# Altium schematic sheet YTN1-E608-WIFI_V1_6432..schdoc
size A3; SheetNumber: 0; SheetTotal: 0
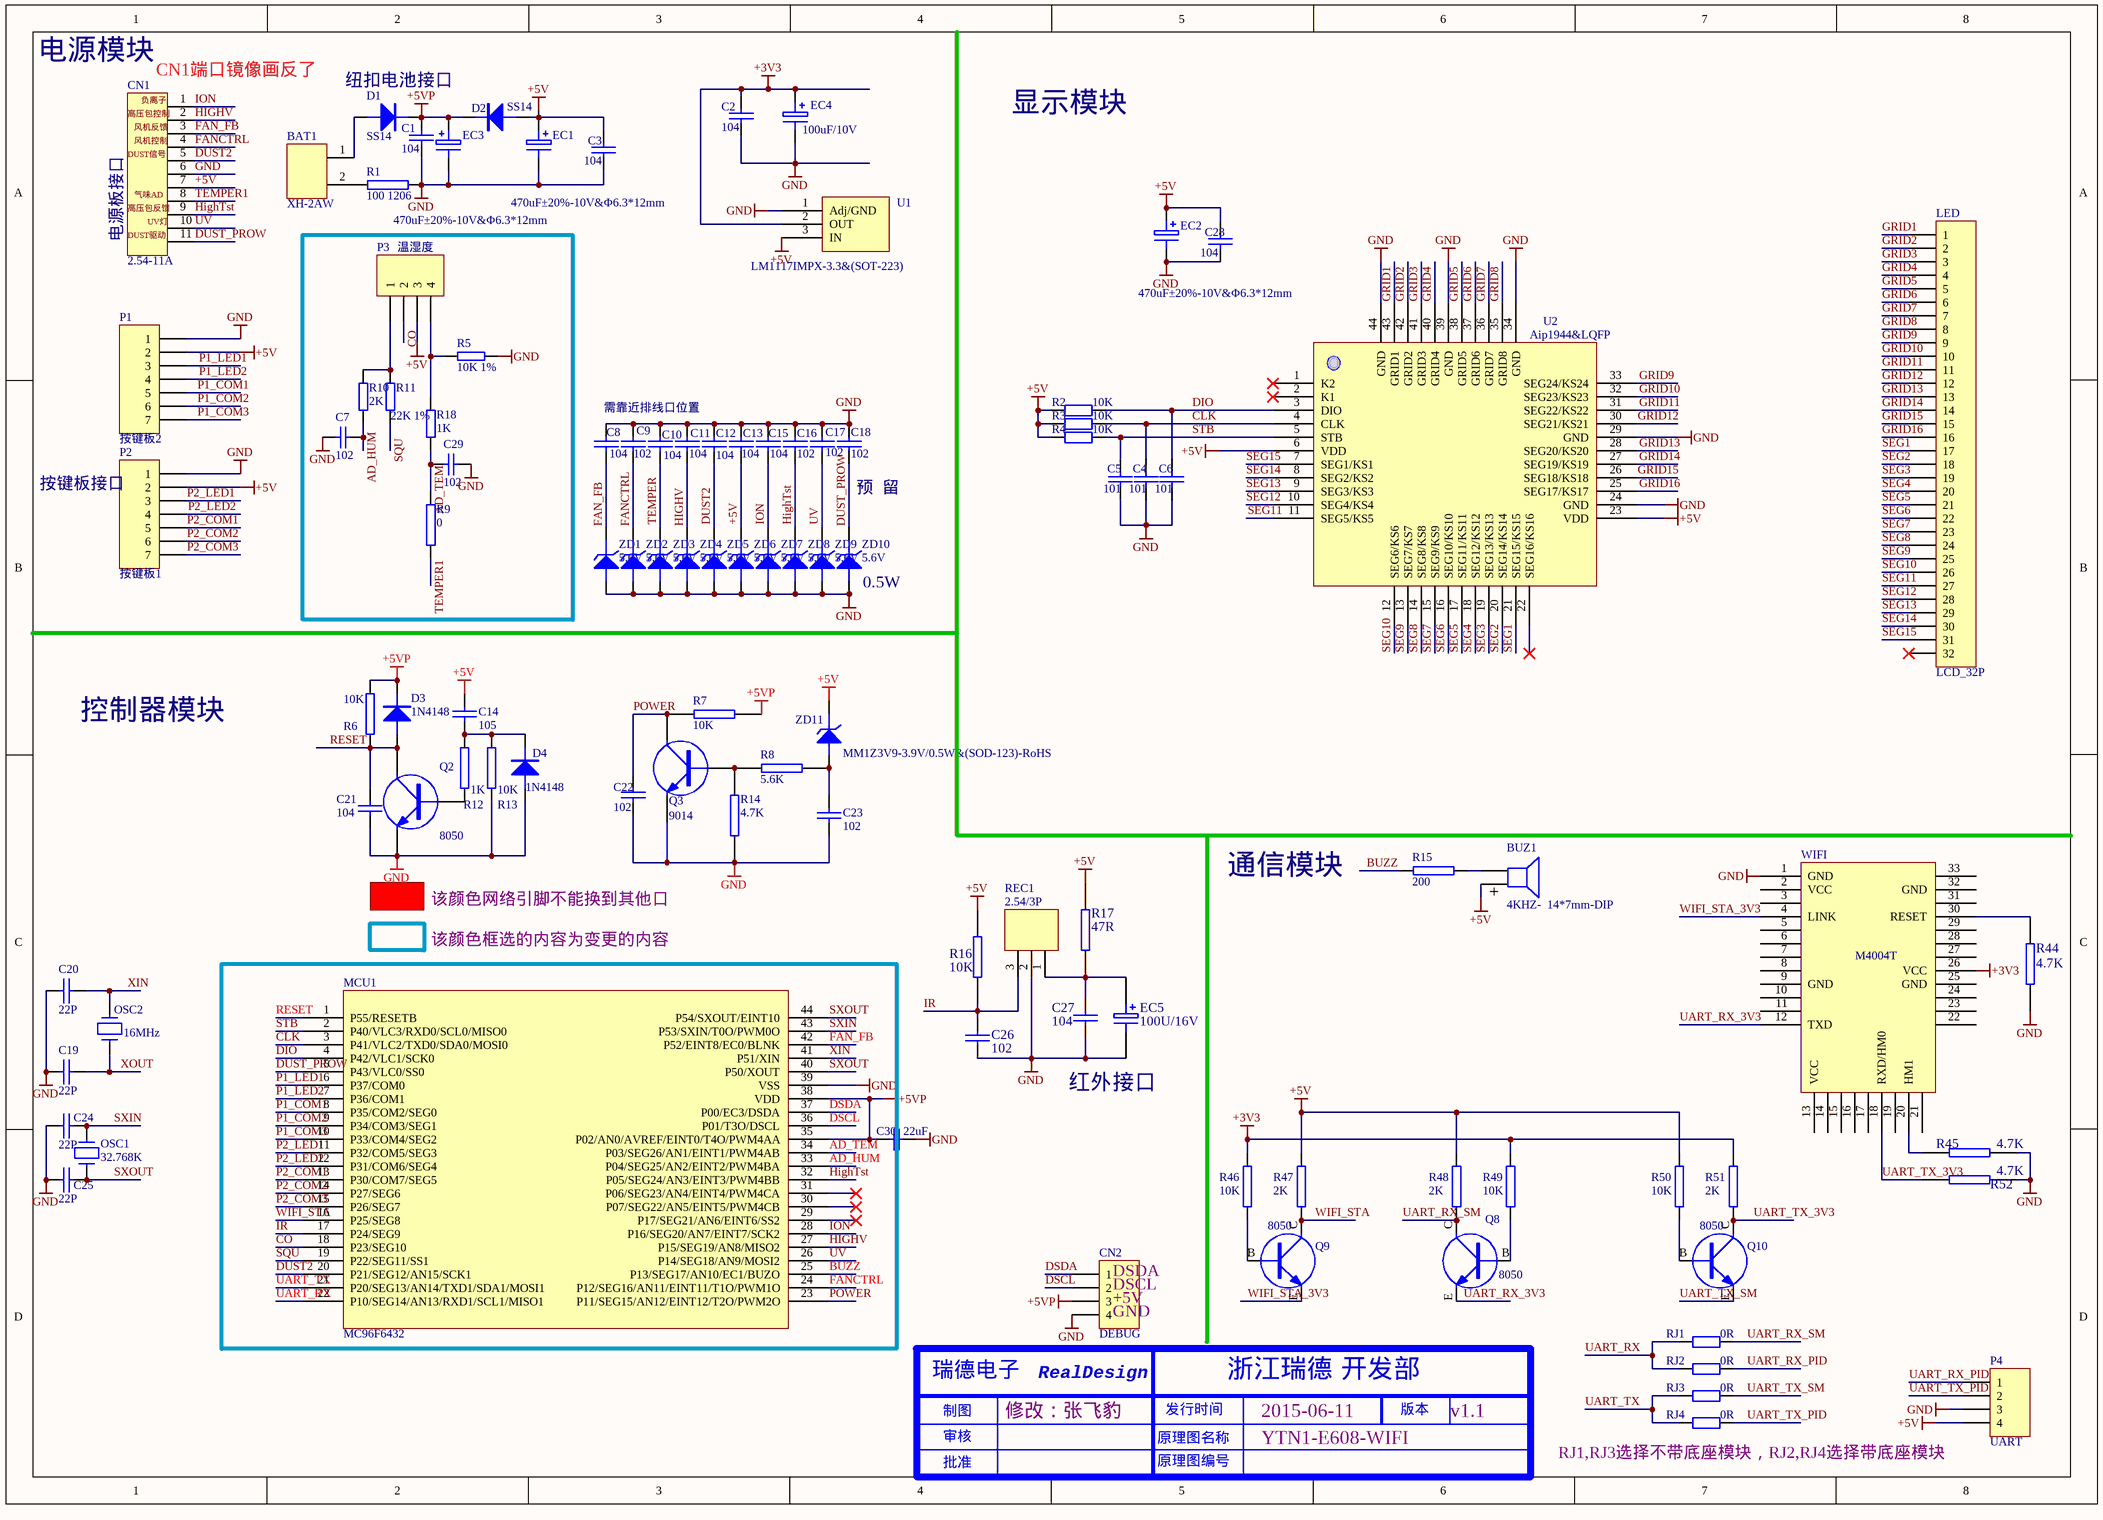
[diagram p0: YTN1-E608-WIFI_V1_6432..schdoc]

## Parts
BAT1  XH-2AW  [XH-2AW-1]
BUZ1  4KHZ-  14*7mm-DIP  [BUZ4K-BCE]
C1  104  [0805C]
C2  104  [0805C]
C3  104  [0805C]
C4  101  [0805C]
C5  101  [0805C]
C6  101  [0805C]
C7  102  [C0805]
C8  104  [0805C]
C9  102  [0805C]
C10  104  [0805C]
C11  104  [0805C]
C12  104  [0805C]
C13  104  [0805C]
C14  105  [0805C]
C15  104  [0805C]
C16  102  [0805C]
C17  102  [0805C]
C18  102  [0805C]
C19  22P  [0805C]
C20  22P  [0805C]
C21  104  [0805C]
C22  102  [0805C]
C23  102  [0805C]
C24  22P  [0805C]
C25  22P  [0805C]
C26  102  [0805C]
C27  104  [0805C]
C28  104  [0805C]
C29  102  [C0805]
C30  22uF  [C0805]
CN1  2.54-11A  [XH-11AW-1]
CN2  DEBUG  [XH-4AW-1]
D1  SS14  [SMA]
D2  SS14  [SMA]
D3  1N4148  [SOD-123]
D4  1N4148  [SOD-123]
EC1  470uF±20%-10V&Φ6.3*12mm  [470UF10V-AI]
EC2  470uF±20%-10V&Φ6.3*12mm  [470UF10V-AI]
EC3  470uF±20%-10V&Φ6.3*12mm  [470UF10V-AI]
EC4  100uF/10V  [100UF10V-AI]
EC5  100U/16V  [100UF16V-AI]
LED  LCD_32P  [HYH]
MCU1  MC96F6432  [QFP44-2]
OSC1  32.768K  [32.768J]
OSC2  16MHz  [CSA4.19MG]
P1  按键板2  [XH-7AW-1]
P2  按键板1  [XH-7AW-1]
P3  温湿度  [HDR1X4]
P4  UART  [XH-4AW-1]
Q2  8050  [SOT-23-S]
Q3  9014  [SOT-23-S]
Q8  8050  [SOT-23-S]
Q9  8050  [SOT-23-S]
Q10  8050  [SOT-23-S]
R1  100 1206  [1206R]
R2  value 10K  [0805R]  (hidden comment: Res2)
R3  value 10K  [0805R]  (hidden comment: Res2)
R4  value 10K  [0805R]  (hidden comment: Res2)
R5  10K 1%  [0805r]
R6  10K  [0805R]
R7  10K  [0805R]
R8  5.6K  [0805R]
R9  0  [0805R]
R10  2K  [0805r]
R11  22K 1%  [0805r]
R12  1K  [0805R]
R13  10K  [0805R]
R14  4.7K  [0805R]
R15  200  [0805R]
R16  10K  [0805R]
R17  47R  [0805-1]
R18  1K  [0805r]
R44  4.7K  [0805R]
R45  4.7K  [0805R]
R46  10K  [0805R]
R47  2K  [0805R]
R48  2K  [0805R]
R49  10K  [0805R]
R50  10K  [0805R]
R51  2K  [0805R]
R52  4.7K  [0805R]
REC1  2.54/3P  [XH-3AW-1]
RJ1  0R  [0805R]
RJ2  0R  [0805R]
RJ3  0R  [0805R]
RJ4  0R  [0805R]
U1  LM1117IMPX-3.3&(SOT-223)
U2  Aip1944&LQFP  [QFP44]
WIFI  M4004T  [M4004T]
ZD1  5.6V  [SOD-123]
ZD2  5.6V  [SOD-123]
ZD3  5.6V  [SOD-123]
ZD4  5.6V  [SOD-123]
ZD5  5.6V  [SOD-123]
ZD6  5.6V  [SOD-123]
ZD7  5.6V  [SOD-123]
ZD8  5.6V  [SOD-123]
ZD9  5.6V  [SOD-123]
ZD10  5.6V  [SOD-123]
ZD11  MM1Z3V9-3.9V/0.5W&(SOD-123)-RoHS  [SOD-123]

## Blocks framed on the sheet
该颜色框选的内容为变更的内容: MCU1

## Nets
+3V3: C2.1 EC4.1 R46.1 R49.1 R51.1 U1.2(OUT) WIFI.26(VCC)
+5V: BUZ1.1 C3.1 C13.2 C14.1 C28.1 CN1.7 D2.A EC1.1 EC2.1 P1.2 P2.2 P3.3 P4.4 R2.2 R3.2 R4.1 R16.2 R17.2 R47.1 R48.1 R50.1 U1.3(IN) U2.6(VDD) U2.23(VDD) ZD6.K ZD11.K
+5VP: C1.1 C30.2 CN2.3 D1.K D2.K D3.K EC3.1 MCU1.35(P02/AN0/AVREF/EINT0/T4O/PWM4AA) MCU1.38(VDD) R6.2 R7.1
GND: C1.2 C2.2 C3.2 C4.2 C5.2 C6.2 C7.2 C8.1 C9.1 C10.1 C11.1 C12.1 C13.1 C15.1 C16.1 C17.1 C18.1 C19.2 C20.2 C21.2 C22.2 C23.2 C24.1 C25.1 C26.2 C27.2 C28.2 C29.1 C30.1 CN1.6 CN2.4 D4.A EC1.2 EC2.2 EC3.2 EC4.2 EC5.2 MCU1.39(VSS) P1.1 P2.1 P4.3 Q2.E Q3.E R1.2 R5.2 R13.1 R14.1 R44.2 R45.1 R52.1 REC1.2 U1.1(Adj/GND) U2.24(GND) U2.29(GND) U2.34(GND) U2.39(GND) U2.44(GND) WIFI.1(GND) ZD1.A ZD2.A ZD3.A ZD4.A ZD5.A ZD6.A ZD7.A ZD8.A ZD9.A ZD10.A
AD_HUM: C7.1 MCU1.33(P04/SEG25/AN2/EINT2/PWM4BA) R10.2
AD_TEM: C29.2 MCU1.34(P03/SEG26/AN1/EINT1/PWM4AB) R9.1 R18.2
BUZZ: MCU1.25(P13/SEG17/AN10/EC1/BUZO) R15.1
CLK: C4.1 MCU1.3(P41/VLC2/TXD0/SDA0/MOSI0) R3.1 U2.4(CLK)
CO: MCU1.18(P23/SEG10) P3.2
DIO: C6.1 MCU1.4(P42/VLC1/SCK0) R2.1 U2.3(DIO)
DSCL: CN2.2 MCU1.36(P01/T3O/DSCL)
DSDA: CN2.1 MCU1.37(P00/EC3/DSDA)
DUST2: C12.2 CN1.5 MCU1.20(P21/SEG12/AN15/SCK1) ZD5.K
DUST_PROW: C18.2 CN1.11 MCU1.5(P43/VLC0/SS0) ZD10.K
FAN_FB: C8.2 CN1.3 MCU1.42(P52/EINT8/EC0/BLNK) ZD1.K
FANCTRL: C9.2 CN1.4 MCU1.24(P12/SEG16/AN11/EINT11/T1O/PWM1O) ZD2.K
GRID1: LED.1 U2.43(GRID1)
GRID2: LED.2 U2.42(GRID2)
GRID3: LED.3 U2.41(GRID3)
GRID4: LED.4 U2.40(GRID4)
GRID5: LED.5 U2.38(GRID5)
GRID6: LED.6 U2.37(GRID6)
GRID7: LED.7 U2.36(GRID7)
GRID8: LED.8 U2.35(GRID8)
GRID9: LED.9 U2.33(SEG24/KS24)
GRID10: LED.10 U2.32(SEG23/KS23)
GRID11: LED.11 U2.31(SEG22/KS22)
GRID12: LED.12 U2.30(SEG21/KS21)
GRID13: LED.13 U2.28(SEG20/KS20)
GRID14: LED.14 U2.27(SEG19/KS19)
GRID15: LED.15 U2.26(SEG18/KS18)
GRID16: LED.16 U2.25(SEG17/KS17)
HighTst: C16.2 CN1.9 MCU1.32(P05/SEG24/AN3/EINT3/PWM4BB) ZD8.K
HIGHV: C11.2 CN1.2 MCU1.27(P15/SEG19/AN8/MISO2) ZD4.K
ION: C15.2 CN1.1 MCU1.28(P16/SEG20/AN7/EINT7/SCK2) ZD7.K
IR: C26.1 MCU1.17(P24/SEG9) R16.1 REC1.3
P1_COM1: MCU1.8(P35/COM2/SEG0) P1.5
P1_COM2: MCU1.9(P34/COM3/SEG1) P1.6
P1_COM3: MCU1.10(P33/COM4/SEG2) P1.7
P1_LED1: MCU1.6(P37/COM0) P1.3
P1_LED2: MCU1.7(P36/COM1) P1.4
P2_COM1: MCU1.13(P30/COM7/SEG5) P2.5
P2_COM2: MCU1.14(P27/SEG6) P2.6
P2_COM3: MCU1.15(P26/SEG7) P2.7
P2_LED1: MCU1.11(P32/COM5/SEG3) P2.3
P2_LED2: MCU1.12(P31/COM6/SEG4) P2.4
POWER: C22.1 MCU1.23(P11/SEG15/AN12/EINT12/T2O/PWM2O) Q3.C R7.2
RESET: C21.1 D3.A MCU1.1(P55/RESETB) Q2.C R6.1
SEG1: LED.17 U2.21(SEG15/KS15)
SEG2: LED.18 U2.20(SEG14/KS14)
SEG3: LED.19 U2.19(SEG13/KS13)
SEG4: LED.20 U2.18(SEG12/KS12)
SEG5: LED.21 U2.17(SEG11/KS11)
SEG6: LED.22 U2.16(SEG10/KS10)
SEG7: LED.23 U2.15(SEG9/KS9)
SEG8: LED.24 U2.14(SEG8/KS8)
SEG9: LED.25 U2.13(SEG7/KS7)
SEG10: LED.26 U2.12(SEG6/KS6)
SEG11: LED.27 U2.11(SEG5/KS5)
SEG12: LED.28 U2.10(SEG4/KS4)
SEG13: LED.29 U2.9(SEG3/KS3)
SEG14: LED.30 U2.8(SEG2/KS2)
SEG15: LED.31 U2.7(SEG1/KS1)
SQU: MCU1.19(P22/SEG11/SS1) R11.2
STB: C5.1 MCU1.2(P40/VLC3/RXD0/SCL0/MISO0) R4.2 U2.5(STB)
SXIN: C24.2 MCU1.43(P53/SXIN/T0O/PWM0O) OSC1.2
SXOUT: C25.2 MCU1.40(P50/XOUT) MCU1.44(P54/SXOUT/EINT10) OSC1.1
TEMPER: C10.2 ZD3.K
TEMPER1: CN1.8 R9.2
UART_RX: MCU1.22(P10/SEG14/AN13/RXD1/SCL1/MISO1) RJ1.1 RJ2.1
UART_RX_3V3: Q8.E WIFI.12(TXD)
UART_RX_PID: P4.1 RJ2.2
UART_RX_SM: Q8.C R48.2 RJ1.2
UART_TX: MCU1.21(P20/SEG13/AN14/TXD1/SDA1/MOSI1) RJ3.1 RJ4.1
UART_TX_3V3: Q10.C R51.2 R52.2 WIFI.18(RXD/HM0)
UART_TX_PID: P4.2 RJ4.2
UART_TX_SM: Q10.E RJ3.2
UV: C17.2 CN1.10 MCU1.26(P14/SEG18/AN9/MOSI2) ZD9.K
WIFI_STA: MCU1.16(P25/SEG8) Q9.C R47.2
WIFI_STA_3V3: Q9.E WIFI.4(LINK)
XIN: C20.1 MCU1.41(P51/XIN) OSC2.3
XOUT: C19.1 OSC2.1
NetBAT1_1: BAT1.1 D1.A
NetBAT1_2: BAT1.2 R1.1
NetBUZ1_2: BUZ1.2 R15.2
NetC14_2: C14.2 D4.K R12.2 R13.2
NetC23_1: C23.1 R8.1 ZD11.A
NetC27_1: C27.1 EC5.1 R17.1 REC1.1
NetP3_1: P3.1 R10.1 R11.1
NetP3_4: P3.4 R5.1 R18.1
NetQ2_B: Q2.B R12.1
NetQ3_B: Q3.B R8.2 R14.2
NetQ8_B: Q8.B R49.2
NetQ9_B: Q9.B R46.2
NetQ10_B: Q10.B R50.2
NetR44_1: R44.1 WIFI.30(RESET)
NetR45_2: R45.2 WIFI.20(HM1)

Not connected (* = marked no-connect by the designer): LED 32*; MCU1 29(P17/SEG21/AN6/EINT6/SS2)* 30(P07/SEG22/AN5/EINT5/PWM4CB)* 31(P06/SEG23/AN4/EINT4/PWM4CA)*; U2 1(K2)* 2(K1)* 22(SEG16/KS16)*; WIFI 2(VCC) 3 5 6 7 8 9(GND) 10 11 13(VCC) 14 15 16 17 19 21 22 23 24 25(GND) 27 28 29 31 32(GND) 33

## Notes on the sheet
- 电源模块
- (near CN1) CN1端口镜像画反了
- (near D1) 纽扣电池接口
- 显示模块
- (near CN1) 电源板接口
- 需靠近排线口位置
- 按键板接口
- 预  留
- (near ZD10) 0.5W
- 控制器模块
- 该颜色网络引脚不能换到其他口
- 通信模块
- (near BUZ1) +
- 红外接口
- (near MCU1) 数码屏驱动口
- (near CN2) DSDA
- (near CN2) DSCL
- (near CN2) +5V
- (near CN2) GND
- 修改：张飞豹
- 2015-06-11
- YTN1-E608-WIFI
- v1.1
- (near RJ4) RJ1,RJ3选择不带底座模块，RJ2,RJ4选择带底座模块
- Labels drawn without touching a wire or pin: DUST信号, DUST驱动, UV灯, 气味AD, 负离子, 风机反馈, 风机控制, 高压包反馈, 高压包控制
- 瑞德电子
- RealDesign
- 浙江瑞德 开发部
- 制图
- 审核
- 原理图名称
- 发行时间
- 版本
- 批准
- 原理图编号

## Library data of the parts
BAT1 = 250-2A
BUZ1 = SPEAKER
C1-C3 C24 C25 C28 = CAP
C4-C6 C8-C23 = CAP: 瓷片电容、独石电容
C7 C29 C30 = Cap: Capacitor; Value: 100pF; Published: 8-Jun-2000; LatestRevisionDate: 17-Jul-2002; LatestRevisionNote: Re-released for DXP Platform.; PackageReference: RAD-0.3; Publisher: Altium Limited
C26 C27 = CAP: Capacitor
CN1 = 3.96-11A
CN2 P3 P4 = Header 4: Header, 4-Pin; LatestRevisionDate: 17-Jul-2002; LatestRevisionNote: Re-released for DXP Platform.; Publisher: Altium Limited
D1-D4 = DIODE: 整流二极管、开关二极管、肖特基二极管、快恢复二极管
EC1 EC2 = ELECTRO: 电解电容正极为"1"号脚
EC3 EC4 = ELECTRO1
EC5 = ELECTRO1: Electrolytic Capacitor
MCU1 = MC96F9432
OSC1 OSC2 = CRYSTAL
P1 P2 = Header 7: Header, 7-Pin; LatestRevisionDate: 17-Jul-2002; LatestRevisionNote: Re-released for DXP Platform.; Publisher: Altium Limited
Q2 Q3 = NPN: 晶体管
Q8-Q10 = NPN: NPN Transistor
R1 R6 R9 R12 R13 R15-R17 R44-R52 = RES2
R2-R4 = Res2: Resistor; Published: 8-Jun-2000; LatestRevisionDate: 17-Jul-2002; LatestRevisionNote: Re-released for DXP Platform.; PackageReference: AXIAL-0.4; Publisher: Altium Limited; PackageDescription: Axial Device, Thru-Hole; 2 Leads; 0.4 in Pin Spacing
R5 R10 R11 R18 = RES2_V: RESISTOR
R7 R8 R14 = R
REC1 = 3.96-3A
RJ1-RJ4 = Res2: Resistor; Value: 1K; Published: 8-Jun-2000; LatestRevisionDate: 17-Jul-2002; LatestRevisionNote: Re-released for DXP Platform.; PackageReference: AXIAL-0.4; Publisher: Altium Limited
U1 = LM1117-3.3V
WIFI = WIFI
ZD1-ZD11 = ZD